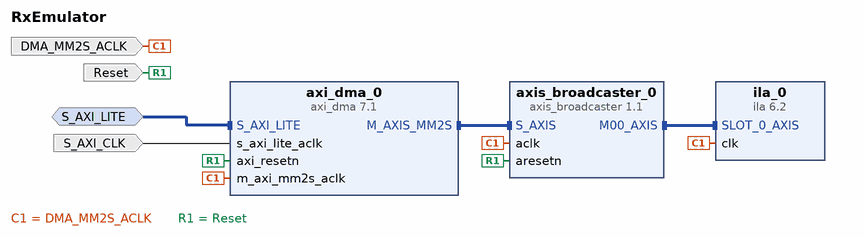
[diagram p0: block diagram of the top level]
# Vivado block design RxEmulator, xc7z020clg400-1, Vivado 2024.1.1
create_bd_design RxEmulator

create_bd_intf_port -mode Slave -vlnv xilinx.com:interface:aximm_rtl:1.0 S_AXI_LITE
set_property -dict [list \
  CONFIG.ADDR_WIDTH 16 \
  CONFIG.ARUSER_WIDTH 0 \
  CONFIG.AWUSER_WIDTH 0 \
  CONFIG.BUSER_WIDTH 0 \
  CONFIG.DATA_WIDTH 32 \
  CONFIG.FREQ_HZ 10000000 \
  CONFIG.HAS_BRESP 1 \
  CONFIG.HAS_BURST 0 \
  CONFIG.HAS_CACHE 0 \
  CONFIG.HAS_LOCK 0 \
  CONFIG.HAS_PROT 0 \
  CONFIG.HAS_QOS 0 \
  CONFIG.HAS_REGION 0 \
  CONFIG.HAS_RRESP 1 \
  CONFIG.HAS_WSTRB 0 \
  CONFIG.ID_WIDTH 0 \
  CONFIG.MAX_BURST_LENGTH 1 \
  CONFIG.NUM_READ_OUTSTANDING 1 \
  CONFIG.NUM_READ_THREADS 1 \
  CONFIG.NUM_WRITE_OUTSTANDING 1 \
  CONFIG.NUM_WRITE_THREADS 1 \
  CONFIG.PROTOCOL AXI4LITE \
  CONFIG.READ_WRITE_MODE READ_WRITE \
  CONFIG.RUSER_BITS_PER_BYTE 0 \
  CONFIG.RUSER_WIDTH 0 \
  CONFIG.SUPPORTS_NARROW_BURST 0 \
  CONFIG.WUSER_BITS_PER_BYTE 0 \
  CONFIG.WUSER_WIDTH 0 \
] [get_bd_intf_ports S_AXI_LITE]
create_bd_port -dir I -type clk S_AXI_CLK
set_property -dict {CONFIG.FREQ_HZ 10000000} [get_bd_ports S_AXI_CLK]
create_bd_port -dir I DMA_MM2S_ACLK
create_bd_port -dir I -type rst Reset

create_bd_cell -type ip -vlnv xilinx.com:ip:axi_dma:7.1 axi_dma_0
set_property -dict [list \
  CONFIG.c_include_s2mm 0 \
  CONFIG.c_include_sg 0 \
  CONFIG.c_m_axis_mm2s_tdata_width 64 \
  CONFIG.c_sg_length_width 26 \
] [get_bd_cells axi_dma_0]
create_bd_cell -type ip -vlnv xilinx.com:ip:axis_broadcaster:1.1 axis_broadcaster_0
set_property -dict [list \
  CONFIG.HAS_TKEEP 0 \
  CONFIG.HAS_TLAST 0 \
  CONFIG.HAS_TREADY 0 \
  CONFIG.HAS_TSTRB 0 \
  CONFIG.M00_TDATA_REMAP {6'b0, tdata[9:0]} \
  CONFIG.M01_TDATA_REMAP {6'b0, tdata[19:10]} \
  CONFIG.M02_TDATA_REMAP {6'b0, tdata[29:20]} \
  CONFIG.M03_TDATA_REMAP {6'b0, tdata[39:30]} \
  CONFIG.M04_TDATA_REMAP {6'b0, tdata[49:40]} \
  CONFIG.M_TDATA_NUM_BYTES 2 \
  CONFIG.M_TUSER_WIDTH 0 \
  CONFIG.NUM_MI 5 \
  CONFIG.S_TDATA_NUM_BYTES 8 \
  CONFIG.S_TUSER_WIDTH 0 \
  CONFIG.TDEST_WIDTH 0 \
  CONFIG.TID_WIDTH 0 \
] [get_bd_cells axis_broadcaster_0]
create_bd_cell -type ip -vlnv xilinx.com:ip:ila:6.2 ila_0
set_property -dict [list \
  CONFIG.ALL_PROBE_SAME_MU_CNT 1 \
  CONFIG.C_MONITOR_TYPE AXI \
  CONFIG.C_NUM_OF_PROBES 9 \
  CONFIG.C_PROBE0_WIDTH 1 \
  CONFIG.C_PROBE1_TYPE 1 \
  CONFIG.C_PROBE1_WIDTH 1 \
  CONFIG.C_PROBE2_TYPE 1 \
  CONFIG.C_PROBE2_WIDTH 1 \
  CONFIG.C_PROBE3_TYPE 1 \
  CONFIG.C_PROBE3_WIDTH 1 \
  CONFIG.C_PROBE4_TYPE 1 \
  CONFIG.C_PROBE4_WIDTH 1 \
  CONFIG.C_SLOT_0_AXIS_TDATA_WIDTH 16 \
  CONFIG.C_SLOT_0_AXIS_TDEST_WIDTH 0 \
  CONFIG.C_SLOT_0_AXIS_TID_WIDTH 0 \
  CONFIG.C_SLOT_0_AXIS_TUSER_WIDTH 0 \
  CONFIG.C_SLOT_0_AXI_PROTOCOL AXI4S \
] [get_bd_cells ila_0]

# ---- connections ----

connect_bd_intf_net [get_bd_intf_pins axi_dma_0/S_AXI_LITE] [get_bd_intf_ports S_AXI_LITE]
connect_bd_intf_net [get_bd_intf_pins axi_dma_0/M_AXIS_MM2S] [get_bd_intf_pins axis_broadcaster_0/S_AXIS]
connect_bd_intf_net [get_bd_intf_pins axis_broadcaster_0/M00_AXIS] [get_bd_intf_pins ila_0/SLOT_0_AXIS]
connect_bd_net [get_bd_ports DMA_MM2S_ACLK] [get_bd_pins ila_0/clk] [get_bd_pins axis_broadcaster_0/aclk] [get_bd_pins axi_dma_0/m_axi_mm2s_aclk]
connect_bd_net [get_bd_ports Reset] [get_bd_pins axi_dma_0/axi_resetn] [get_bd_pins axis_broadcaster_0/aresetn]
connect_bd_net [get_bd_ports S_AXI_CLK] [get_bd_pins axi_dma_0/s_axi_lite_aclk]

# ---- address map ----
assign_bd_address -offset 0x0000 -range 4K -target_address_space [get_bd_addr_spaces S_AXI_LITE] [get_bd_addr_segs axi_dma_0/S_AXI_LITE/Reg]

set_property USER_COMMENTS.comment_0 {Make clock?
} [current_bd_design]

validate_bd_design
save_bd_design
